# EAGLE schematic 7x7RGB-IR-J010129A (EAGLE 7.7.0)

## Sheet 1 of 2
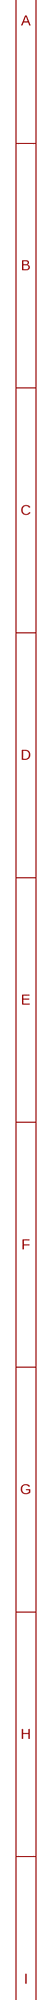
[diagram p0: schematic, sheet 1, part 1 of 2]
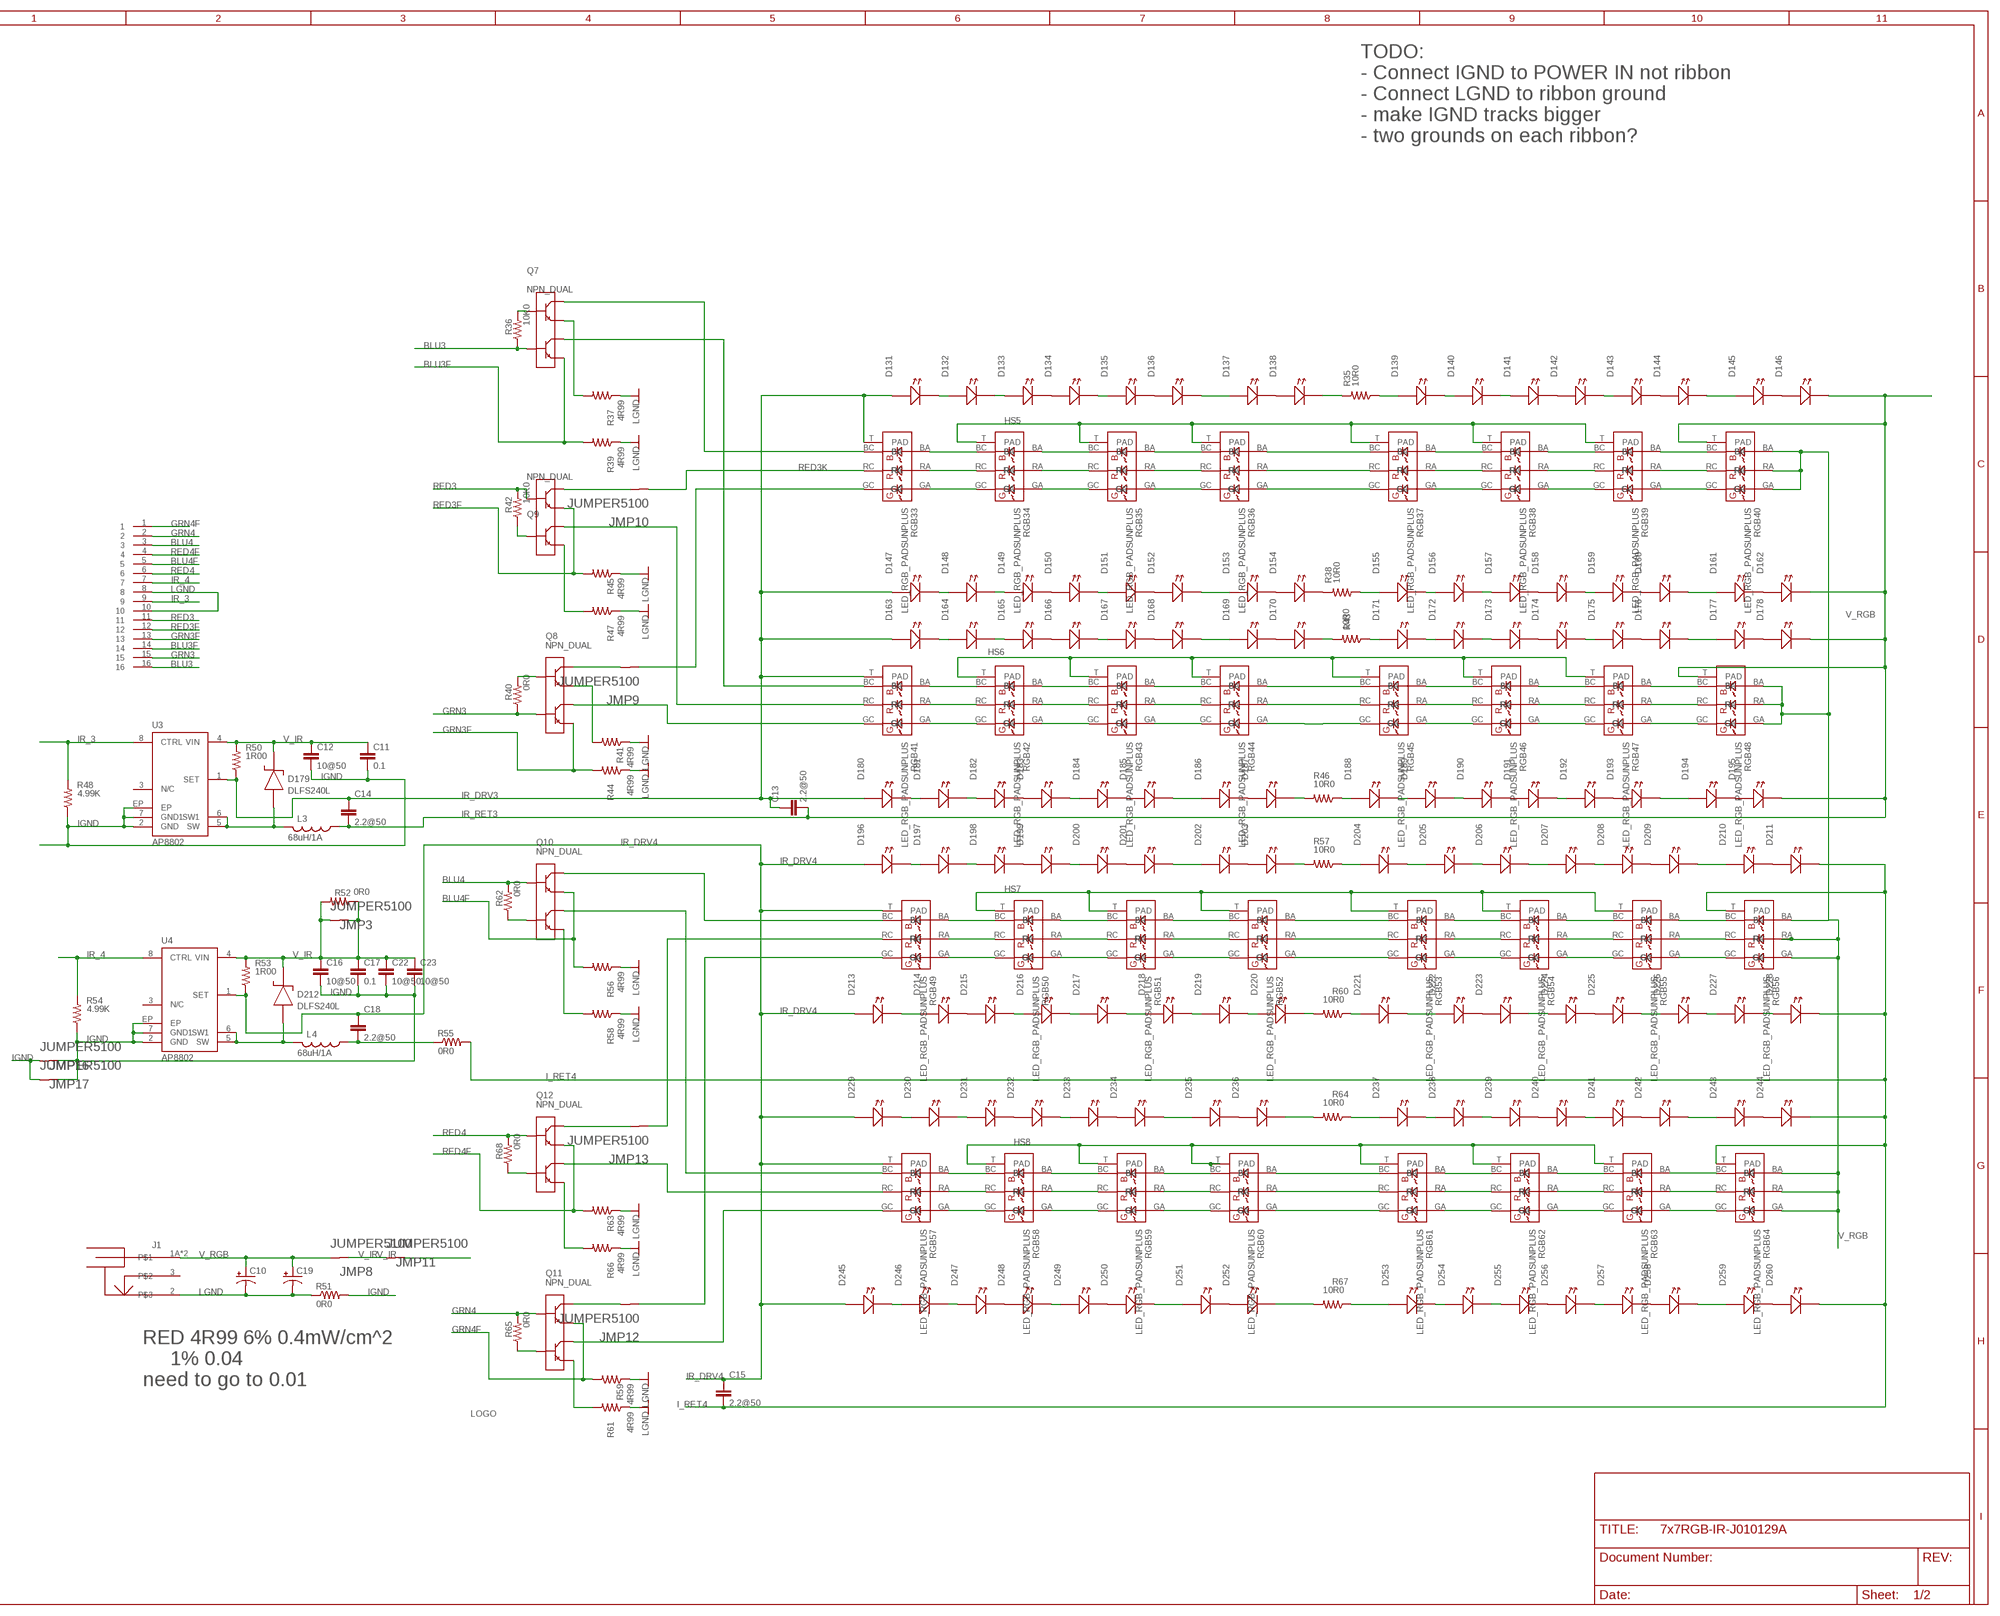
[diagram p1: schematic, sheet 1, part 2 of 2]

### Parts
C10  CPOL-US153CLV-0810  [153CLV-0810]
C11  0.1  CAPS0805S  [0805S]
C12  10@50  CAPS1210S  [1210S]
C13  2.2@50  CAPS1206S  [1206S]
C14  2.2@50  CAPS1206S  [1206S]
C15  2.2@50  CAPS1206S  [1206S]
C16  10@50  CAPS1210S  [1210S]
C17  0.1  CAPS0805S  [0805S]
C18  2.2@50  CAPS1206S  [1206S]
C19  CPOL-US153CLV-0810  [153CLV-0810]
C22  10@50  CAPS1210S  [1210S]
C23  10@50  CAPS1210S  [1210S]
D131  LEDLED_SFH4050  [LED_SFH4050]
D132  LEDLED_SFH4050  [LED_SFH4050]
D133  LEDLED_SFH4050  [LED_SFH4050]
D134  LEDLED_SFH4050  [LED_SFH4050]
D135  LEDLED_SFH4050  [LED_SFH4050]
D136  LEDLED_SFH4050  [LED_SFH4050]
D137  LEDLED_SFH4050  [LED_SFH4050]
D138  LEDLED_SFH4050  [LED_SFH4050]
D139  LEDLED_SFH4050  [LED_SFH4050]
D140  LEDLED_SFH4050  [LED_SFH4050]
D141  LEDLED_SFH4050  [LED_SFH4050]
D142  LEDLED_SFH4050  [LED_SFH4050]
D143  LEDLED_SFH4050  [LED_SFH4050]
D144  LEDLED_SFH4050  [LED_SFH4050]
D145  LEDLED_SFH4050  [LED_SFH4050]
D146  LEDLED_SFH4050  [LED_SFH4050]
D147  LEDLED_SFH4050  [LED_SFH4050]
D148  LEDLED_SFH4050  [LED_SFH4050]
D149  LEDLED_SFH4050  [LED_SFH4050]
D150  LEDLED_SFH4050  [LED_SFH4050]
D151  LEDLED_SFH4050  [LED_SFH4050]
D152  LEDLED_SFH4050  [LED_SFH4050]
D153  LEDLED_SFH4050  [LED_SFH4050]
D154  LEDLED_SFH4050  [LED_SFH4050]
D155  LEDLED_SFH4050  [LED_SFH4050]
D156  LEDLED_SFH4050  [LED_SFH4050]
D157  LEDLED_SFH4050  [LED_SFH4050]
D158  LEDLED_SFH4050  [LED_SFH4050]
D159  LEDLED_SFH4050  [LED_SFH4050]
D160  LEDLED_SFH4050  [LED_SFH4050]
D161  LEDLED_SFH4050  [LED_SFH4050]
D162  LEDLED_SFH4050  [LED_SFH4050]
D163  LEDLED_SFH4050  [LED_SFH4050]
D164  LEDLED_SFH4050  [LED_SFH4050]
D165  LEDLED_SFH4050  [LED_SFH4050]
D166  LEDLED_SFH4050  [LED_SFH4050]
D167  LEDLED_SFH4050  [LED_SFH4050]
D168  LEDLED_SFH4050  [LED_SFH4050]
D169  LEDLED_SFH4050  [LED_SFH4050]
D170  LEDLED_SFH4050  [LED_SFH4050]
D171  LEDLED_SFH4050  [LED_SFH4050]
D172  LEDLED_SFH4050  [LED_SFH4050]
D173  LEDLED_SFH4050  [LED_SFH4050]
D174  LEDLED_SFH4050  [LED_SFH4050]
D175  LEDLED_SFH4050  [LED_SFH4050]
D176  LEDLED_SFH4050  [LED_SFH4050]
D177  LEDLED_SFH4050  [LED_SFH4050]
D178  LEDLED_SFH4050  [LED_SFH4050]
D179  DLFS240L  DIODE_SCHOTTKYPWRDI-123  [PWRDI-123]
D180  LEDLED_SFH4050  [LED_SFH4050]
D181  LEDLED_SFH4050  [LED_SFH4050]
D182  LEDLED_SFH4050  [LED_SFH4050]
D183  LEDLED_SFH4050  [LED_SFH4050]
D184  LEDLED_SFH4050  [LED_SFH4050]
D185  LEDLED_SFH4050  [LED_SFH4050]
D186  LEDLED_SFH4050  [LED_SFH4050]
D187  LEDLED_SFH4050  [LED_SFH4050]
D188  LEDLED_SFH4050  [LED_SFH4050]
D189  LEDLED_SFH4050  [LED_SFH4050]
D190  LEDLED_SFH4050  [LED_SFH4050]
D191  LEDLED_SFH4050  [LED_SFH4050]
D192  LEDLED_SFH4050  [LED_SFH4050]
D193  LEDLED_SFH4050  [LED_SFH4050]
D194  LEDLED_SFH4050  [LED_SFH4050]
D195  LEDLED_SFH4050  [LED_SFH4050]
D196  LEDLED_SFH4050  [LED_SFH4050]
D197  LEDLED_SFH4050  [LED_SFH4050]
D198  LEDLED_SFH4050  [LED_SFH4050]
D199  LEDLED_SFH4050  [LED_SFH4050]
D200  LEDLED_SFH4050  [LED_SFH4050]
D201  LEDLED_SFH4050  [LED_SFH4050]
D202  LEDLED_SFH4050  [LED_SFH4050]
D203  LEDLED_SFH4050  [LED_SFH4050]
D204  LEDLED_SFH4050  [LED_SFH4050]
D205  LEDLED_SFH4050  [LED_SFH4050]
D206  LEDLED_SFH4050  [LED_SFH4050]
D207  LEDLED_SFH4050  [LED_SFH4050]
D208  LEDLED_SFH4050  [LED_SFH4050]
D209  LEDLED_SFH4050  [LED_SFH4050]
D210  LEDLED_SFH4050  [LED_SFH4050]
D211  LEDLED_SFH4050  [LED_SFH4050]
D212  DLFS240L  DIODE_SCHOTTKYPWRDI-123  [PWRDI-123]
D213  LEDLED_SFH4050  [LED_SFH4050]
D214  LEDLED_SFH4050  [LED_SFH4050]
D215  LEDLED_SFH4050  [LED_SFH4050]
D216  LEDLED_SFH4050  [LED_SFH4050]
D217  LEDLED_SFH4050  [LED_SFH4050]
D218  LEDLED_SFH4050  [LED_SFH4050]
D219  LEDLED_SFH4050  [LED_SFH4050]
D220  LEDLED_SFH4050  [LED_SFH4050]
D221  LEDLED_SFH4050  [LED_SFH4050]
D222  LEDLED_SFH4050  [LED_SFH4050]
D223  LEDLED_SFH4050  [LED_SFH4050]
D224  LEDLED_SFH4050  [LED_SFH4050]
D225  LEDLED_SFH4050  [LED_SFH4050]
D226  LEDLED_SFH4050  [LED_SFH4050]
D227  LEDLED_SFH4050  [LED_SFH4050]
D228  LEDLED_SFH4050  [LED_SFH4050]
D229  LEDLED_SFH4050  [LED_SFH4050]
D230  LEDLED_SFH4050  [LED_SFH4050]
D231  LEDLED_SFH4050  [LED_SFH4050]
D232  LEDLED_SFH4050  [LED_SFH4050]
D233  LEDLED_SFH4050  [LED_SFH4050]
D234  LEDLED_SFH4050  [LED_SFH4050]
D235  LEDLED_SFH4050  [LED_SFH4050]
D236  LEDLED_SFH4050  [LED_SFH4050]
D237  LEDLED_SFH4050  [LED_SFH4050]
D238  LEDLED_SFH4050  [LED_SFH4050]
D239  LEDLED_SFH4050  [LED_SFH4050]
D240  LEDLED_SFH4050  [LED_SFH4050]
D241  LEDLED_SFH4050  [LED_SFH4050]
D242  LEDLED_SFH4050  [LED_SFH4050]
D243  LEDLED_SFH4050  [LED_SFH4050]
D244  LEDLED_SFH4050  [LED_SFH4050]
D245  LEDLED_SFH4050  [LED_SFH4050]
D246  LEDLED_SFH4050  [LED_SFH4050]
D247  LEDLED_SFH4050  [LED_SFH4050]
D248  LEDLED_SFH4050  [LED_SFH4050]
D249  LEDLED_SFH4050  [LED_SFH4050]
D250  LEDLED_SFH4050  [LED_SFH4050]
D251  LEDLED_SFH4050  [LED_SFH4050]
D252  LEDLED_SFH4050  [LED_SFH4050]
D253  LEDLED_SFH4050  [LED_SFH4050]
D254  LEDLED_SFH4050  [LED_SFH4050]
D255  LEDLED_SFH4050  [LED_SFH4050]
D256  LEDLED_SFH4050  [LED_SFH4050]
D257  LEDLED_SFH4050  [LED_SFH4050]
D258  LEDLED_SFH4050  [LED_SFH4050]
D259  LEDLED_SFH4050  [LED_SFH4050]
D260  LEDLED_SFH4050  [LED_SFH4050]
J1  POWER_JACK_SHUNTPJ-002  [PJ-002]
JMP3  JUMPER5100  [5100]
JMP8  JUMPER5100  [5100]
JMP9  JUMPER5100  [5100]
JMP10  JUMPER5100  [5100]
JMP11  JUMPER5100  [5100]
JMP12  JUMPER5100  [5100]
JMP13  JUMPER5100  [5100]
JMP16  JUMPER5100  [5100]
JMP17  JUMPER5100  [5100]
L3  68uH/1A  INDUCTOR_SMSRU8043  [SRU8043]
L4  68uH/1A  INDUCTOR_SMSRU8043  [SRU8043]
P2  CON162X8SM-SMALL  [HEADER2X8_SM_SMALL]
Q7  NPN_DUAL  [LFPAK56D]
Q8  NPN_DUAL  [LFPAK56D]
Q9  NPN_DUAL  [LFPAK56D]
Q10  NPN_DUAL  [LFPAK56D]
Q11  NPN_DUAL  [LFPAK56D]
Q12  NPN_DUAL  [LFPAK56D]
R35  10R0  RESISTOR_SM1206S  [1206S]
R36  10K0  RESISTOR_SM1206S  [1206S]
R37  4R99  R-US_R2512  [R2512]
R38  10R0  RESISTOR_SM1206S  [1206S]
R39  4R99  R-US_R2512  [R2512]
R40  0R0  RESISTOR_SM1206S  [1206S]
R41  4R99  R-US_R2512  [R2512]
R42  10K0  RESISTOR_SM1206S  [1206S]
R43  10R0  RESISTOR_SM1206S  [1206S]
R44  4R99  R-US_R2512  [R2512]
R45  4R99  R-US_R2512  [R2512]
R46  10R0  RESISTOR_SM1206S  [1206S]
R47  4R99  R-US_R2512  [R2512]
R48  4.99K  RESISTOR_SM0805S  [0805S]
R50  1R00  RESISTOR_SM1206S  [1206S]
R51  0R0  RESISTOR_SM1206S  [1206S]
R52  0R0  R-US_R1206  [R1206]
R53  1R00  RESISTOR_SM1206S  [1206S]
R54  4.99K  RESISTOR_SM0805S  [0805S]
R55  0R0  RESISTOR_SM1206S  [1206S]
R56  4R99  R-US_R2512  [R2512]
R57  10R0  RESISTOR_SM1206S  [1206S]
R58  4R99  R-US_R2512  [R2512]
R59  4R99  R-US_R2512  [R2512]
R60  10R0  RESISTOR_SM1206S  [1206S]
R61  4R99  R-US_R2512  [R2512]
R62  0R0  RESISTOR_SM1206S  [1206S]
R63  4R99  R-US_R2512  [R2512]
R64  10R0  RESISTOR_SM1206S  [1206S]
R65  0R0  RESISTOR_SM1206S  [1206S]
R66  4R99  R-US_R2512  [R2512]
R67  10R0  RESISTOR_SM1206S  [1206S]
R68  0R0  RESISTOR_SM1206S  [1206S]
RGB33  LED_RGB_PADSUNPLUS  [SUNPLUS_RGB]
RGB34  LED_RGB_PADSUNPLUS  [SUNPLUS_RGB]
RGB35  LED_RGB_PADSUNPLUS  [SUNPLUS_RGB]
RGB36  LED_RGB_PADSUNPLUS  [SUNPLUS_RGB]
RGB37  LED_RGB_PADSUNPLUS  [SUNPLUS_RGB]
RGB38  LED_RGB_PADSUNPLUS  [SUNPLUS_RGB]
RGB39  LED_RGB_PADSUNPLUS  [SUNPLUS_RGB]
RGB40  LED_RGB_PADSUNPLUS  [SUNPLUS_RGB]
RGB41  LED_RGB_PADSUNPLUS  [SUNPLUS_RGB]
RGB42  LED_RGB_PADSUNPLUS  [SUNPLUS_RGB]
RGB43  LED_RGB_PADSUNPLUS  [SUNPLUS_RGB]
RGB44  LED_RGB_PADSUNPLUS  [SUNPLUS_RGB]
RGB45  LED_RGB_PADSUNPLUS  [SUNPLUS_RGB]
RGB46  LED_RGB_PADSUNPLUS  [SUNPLUS_RGB]
RGB47  LED_RGB_PADSUNPLUS  [SUNPLUS_RGB]
RGB48  LED_RGB_PADSUNPLUS  [SUNPLUS_RGB]
RGB49  LED_RGB_PADSUNPLUS  [SUNPLUS_RGB]
RGB50  LED_RGB_PADSUNPLUS  [SUNPLUS_RGB]
RGB51  LED_RGB_PADSUNPLUS  [SUNPLUS_RGB]
RGB52  LED_RGB_PADSUNPLUS  [SUNPLUS_RGB]
RGB53  LED_RGB_PADSUNPLUS  [SUNPLUS_RGB]
RGB54  LED_RGB_PADSUNPLUS  [SUNPLUS_RGB]
RGB55  LED_RGB_PADSUNPLUS  [SUNPLUS_RGB]
RGB56  LED_RGB_PADSUNPLUS  [SUNPLUS_RGB]
RGB57  LED_RGB_PADSUNPLUS  [SUNPLUS_RGB]
RGB58  LED_RGB_PADSUNPLUS  [SUNPLUS_RGB]
RGB59  LED_RGB_PADSUNPLUS  [SUNPLUS_RGB]
RGB60  LED_RGB_PADSUNPLUS  [SUNPLUS_RGB]
RGB61  LED_RGB_PADSUNPLUS  [SUNPLUS_RGB]
RGB62  LED_RGB_PADSUNPLUS  [SUNPLUS_RGB]
RGB63  LED_RGB_PADSUNPLUS  [SUNPLUS_RGB]
RGB64  LED_RGB_PADSUNPLUS  [SUNPLUS_RGB]
U3  AP8802  [SOIC8-EP]
U4  AP8802  [SOIC8-EP]
U$19  JFRC-LOGOLOGO_OP  [LOGO_BMP_OP]

### Nets
BLU3: P2.16 Q7.4(B2) R36.1
BLU3F: P2.14 Q7.3(E2) R39.2
BLU3K: Q7.7(C1) Q7.8(C1) Q7.78(C1) RGB33.BC
BLU4: P2.3 Q10.2(B1) R62.2
BLU4F: P2.5 Q10.1(E1) R56.2
G4: Q11.3(E2) R61.2
G4A: Q11.4(B2) R65.1
GRN3: P2.15 Q8.4(B2) R40.1
GRN3F: P2.13 Q8.3(E2) R44.2
GRN3K: JMP9.1 RGB33.GC
GRN4: P2.2 Q11.2(B1) R65.2
GRN4F: P2.1 Q11.1(E1) R59.2
GULA_1: Q11.5(C2) Q11.6(C2) Q11.56(C2) RGB57.GC
GULA_2: Q12.5(C2) Q12.6(C2) Q12.56(C2) RGB57.RC
GULA_3: Q8.5(C2) Q8.6(C2) Q8.56(C2) RGB41.GC
GULA_4: Q9.5(C2) Q9.6(C2) Q9.56(C2) RGB41.RC
HS5: RGB34.T(PAD) RGB35.T(PAD) RGB36.T(PAD) RGB37.T(PAD) RGB38.T(PAD) RGB39.T(PAD)
HS6: RGB42.T(PAD) RGB43.T(PAD) RGB44.T(PAD) RGB45.T(PAD) RGB46.T(PAD) RGB47.T(PAD)
HS7: RGB50.T(PAD) RGB51.T(PAD) RGB52.T(PAD) RGB53.T(PAD) RGB54.T(PAD) RGB55.T(PAD)
HS8: RGB58.T(PAD) RGB59.T(PAD) RGB60.T(PAD) RGB61.T(PAD) RGB62.T(PAD) RGB63.T(PAD)
I_RET4: C15.2 D211.C(K) D228.C(K) D244.C(K) D260.C(K) R55.2 RGB56.T(PAD) RGB64.T(PAD)
IGND: C11.2 C12.2 C16.2 C17.2 C22.2 C23.2 JMP16.1 JMP16.2 JMP17.1 JMP17.2 R48.1 R51.2 R54.1 U3.2(GND) U3.7(GND1) U3.EP U4.2(GND) U4.7(GND1) U4.EP
IR_3: P2.9 R48.2 U3.8(CTRL)
IR_4: P2.7 R54.2 U4.8(CTRL)
IR_DRV3: C13.1 C14.1 D131.A D147.A D163.A D180.A R50.1 RGB33.T(PAD) RGB41.T(PAD) U3.1(SET)
IR_DRV4: C15.1 C18.1 D196.A D213.A D229.A D245.A R53.1 RGB49.T(PAD) RGB57.T(PAD) U4.1(SET)
IR_RET3: C13.2 C14.2 D146.C(K) D162.C(K) D178.C(K) D195.C(K) L3.1 RGB40.T(PAD) RGB48.T(PAD)
LGND: C10.- C19.- J1.2 P2.8 P2.10 R37.1 R39.1 R41.1 R44.1 R45.1 R47.1 R51.1 R56.1 R58.1 R59.1 R61.1 R63.1 R66.1 ; also sheet 2
N$2: D227.C(K) D228.A
N$3: Q12.4(B2) R68.1
N$4: Q8.1(E1) R41.2
N$5: JMP12.1 RGB49.GC
N$6: Q10.7(C1) Q10.8(C1) Q10.78(C1) RGB49.BC
N$8: Q10.5(C2) Q10.6(C2) Q10.56(C2) RGB57.BC
N$9: Q9.3(E2) R47.2
N$10: Q9.4(B2) R42.1
N$11: Q8.2(B1) R40.2
N$14: D139.A R35.1
N$15: JMP13.2 Q12.7(C1) Q12.8(C1) Q12.78(C1)
N$16: JMP12.2 Q11.7(C1) Q11.8(C1) Q11.78(C1)
N$17: D138.C(K) R35.2
N$18: D154.C(K) R38.2
N$19: D155.A R38.1
N$20: JMP13.1 RGB49.RC
N$21: D171.A R43.1
N$22: D170.C(K) R43.2
N$23: D188.A R46.1
N$24: D187.C(K) R46.2
N$25: D203.C(K) R57.2
N$26: RGB63.BA RGB64.BC
N$27: D212.A L4.2 U4.5(SW) U4.6(SW1)
N$29: C18.2 L4.1 R55.1
N$30: RGB63.RA RGB64.RC
N$31: D204.A R57.1
N$32: D221.A R60.1
N$33: D220.C(K) R60.2
N$34: D237.A R64.1
N$35: Q10.4(B2) R62.1
N$36: Q10.3(E2) R58.2
N$37: D236.C(K) R64.2
N$38: D253.A R67.1
N$39: D252.C(K) R67.2
N$67: D179.A L3.2 U3.5(SW) U3.6(SW1)
N$97: RGB47.GA RGB48.GC
N$177: RGB46.GA RGB47.GC
N$178: RGB45.GA RGB46.GC
N$179: RGB44.GA RGB45.GC
N$181: RGB43.GA RGB44.GC
N$188: RGB42.GA RGB43.GC
N$190: RGB63.GA RGB64.GC
N$230: RGB41.GA RGB42.GC
N$233: RGB47.RA RGB48.RC
N$235: RGB46.RA RGB47.RC
N$238: RGB45.RA RGB46.RC
N$239: RGB44.RA RGB45.RC
N$240: RGB43.RA RGB44.RC
N$241: RGB42.RA RGB43.RC
N$242: RGB41.RA RGB42.RC
N$243: RGB41.BA RGB42.BC
N$244: RGB42.BA RGB43.BC
N$245: RGB43.BA RGB44.BC
N$248: RGB44.BA RGB45.BC
N$249: RGB45.BA RGB46.BC
N$250: RGB46.BA RGB47.BC
N$251: RGB47.BA RGB48.BC
N$256: D181.C(K) D182.A
N$257: D182.C(K) D183.A
N$261: RGB33.RA RGB34.RC
N$264: D184.C(K) D185.A
N$265: D186.C(K) D187.A
N$268: D180.C(K) D181.A
N$269: D183.C(K) D184.A
N$270: D185.C(K) D186.A
N$271: D189.C(K) D190.A
N$272: D190.C(K) D191.A
N$273: D192.C(K) D193.A
N$274: D194.C(K) D195.A
N$275: D188.C(K) D189.A
N$276: D191.C(K) D192.A
N$277: D193.C(K) D194.A
N$278: D164.C(K) D165.A
N$279: D165.C(K) D166.A
N$280: D167.C(K) D168.A
N$281: D169.C(K) D170.A
N$282: D163.C(K) D164.A
N$283: D166.C(K) D167.A
N$284: D168.C(K) D169.A
N$285: D172.C(K) D173.A
N$286: D173.C(K) D174.A
N$287: D175.C(K) D176.A
N$288: D177.C(K) D178.A
N$289: D171.C(K) D172.A
N$290: D174.C(K) D175.A
N$291: D176.C(K) D177.A
N$294: RGB55.GA RGB56.GC
N$295: RGB54.GA RGB55.GC
N$296: RGB53.GA RGB54.GC
N$297: RGB52.GA RGB53.GC
N$298: RGB51.GA RGB52.GC
N$299: RGB50.GA RGB51.GC
N$300: RGB49.GA RGB50.GC
N$301: RGB55.RA RGB56.RC
N$302: RGB54.RA RGB55.RC
N$303: RGB53.RA RGB54.RC
N$304: RGB52.RA RGB53.RC
N$305: RGB51.RA RGB52.RC
N$306: RGB50.RA RGB51.RC
N$307: RGB49.RA RGB50.RC
N$308: RGB49.BA RGB50.BC
N$309: RGB50.BA RGB51.BC
N$310: RGB51.BA RGB52.BC
N$311: RGB52.BA RGB53.BC
N$312: RGB53.BA RGB54.BC
N$313: RGB54.BA RGB55.BC
N$314: RGB55.BA RGB56.BC
N$315: D197.C(K) D198.A
N$316: D198.C(K) D199.A
N$317: D200.C(K) D201.A
N$318: D202.C(K) D203.A
N$319: D196.C(K) D197.A
N$320: D199.C(K) D200.A
N$321: D201.C(K) D202.A
N$322: D205.C(K) D206.A
N$323: D206.C(K) D207.A
N$324: D208.C(K) D209.A
N$325: D210.C(K) D211.A
N$326: D204.C(K) D205.A
N$327: D207.C(K) D208.A
N$328: D209.C(K) D210.A
N$329: D214.C(K) D215.A
N$330: D215.C(K) D216.A
N$331: D217.C(K) D218.A
N$332: D219.C(K) D220.A
N$333: D213.C(K) D214.A
N$334: D216.C(K) D217.A
N$335: D218.C(K) D219.A
N$336: D222.C(K) D223.A
N$337: D224.C(K) D225.A
N$338: D226.C(K) D227.A
N$339: D221.C(K) D222.A
N$340: D223.C(K) D224.A
N$341: D225.C(K) D226.A
N$344: RGB39.GA RGB40.GC
N$345: RGB38.GA RGB39.GC
N$346: RGB37.GA RGB38.GC
N$347: RGB36.GA RGB37.GC
N$348: RGB35.GA RGB36.GC
N$349: RGB34.GA RGB35.GC
N$350: RGB33.GA RGB34.GC
N$351: RGB39.RA RGB40.RC
N$352: RGB38.RA RGB39.RC
N$353: RGB37.RA RGB38.RC
N$354: RGB36.RA RGB37.RC
N$355: RGB35.RA RGB36.RC
N$356: RGB34.RA RGB35.RC
N$358: RGB33.BA RGB34.BC
N$359: RGB34.BA RGB35.BC
N$360: RGB35.BA RGB36.BC
N$361: RGB36.BA RGB37.BC
N$362: RGB37.BA RGB38.BC
N$363: RGB38.BA RGB39.BC
N$364: RGB39.BA RGB40.BC
N$365: D132.C(K) D133.A
N$366: D133.C(K) D134.A
N$367: D135.C(K) D136.A
N$368: D137.C(K) D138.A
N$369: D131.C(K) D132.A
N$370: D134.C(K) D135.A
N$371: D136.C(K) D137.A
N$372: D140.C(K) D141.A
N$373: D141.C(K) D142.A
N$374: D143.C(K) D144.A
N$375: D145.C(K) D146.A
N$376: D139.C(K) D140.A
N$377: D142.C(K) D143.A
N$378: D144.C(K) D145.A
N$379: D148.C(K) D149.A
N$380: D149.C(K) D150.A
N$381: D151.C(K) D152.A
N$382: D153.C(K) D154.A
N$383: D147.C(K) D148.A
N$384: D150.C(K) D151.A
N$385: D152.C(K) D153.A
N$386: D156.C(K) D157.A
N$387: D157.C(K) D158.A
N$388: D159.C(K) D160.A
N$389: D161.C(K) D162.A
N$390: D155.C(K) D156.A
N$391: D158.C(K) D159.A
N$392: D160.C(K) D161.A
N$400: Q7.1(E1) R37.2
N$401: Q7.5(C2) Q7.6(C2) Q7.56(C2) RGB41.BC
N$404: RGB62.GA RGB63.GC
N$405: RGB61.GA RGB62.GC
N$406: RGB60.GA RGB61.GC
N$407: RGB59.GA RGB60.GC
N$408: RGB58.GA RGB59.GC
N$409: RGB57.GA RGB58.GC
N$411: RGB62.RA RGB63.RC
N$412: RGB61.RA RGB62.RC
N$413: RGB60.RA RGB61.RC
N$414: RGB59.RA RGB60.RC
N$415: RGB58.RA RGB59.RC
N$416: RGB57.RA RGB58.RC
N$417: RGB57.BA RGB58.BC
N$418: RGB58.BA RGB59.BC
N$419: RGB59.BA RGB60.BC
N$420: RGB60.BA RGB61.BC
N$421: RGB61.BA RGB62.BC
N$422: RGB62.BA RGB63.BC
N$424: D230.C(K) D231.A
N$425: D231.C(K) D232.A
N$426: D233.C(K) D234.A
N$427: D235.C(K) D236.A
N$428: D229.C(K) D230.A
N$429: D232.C(K) D233.A
N$430: D234.C(K) D235.A
N$431: D238.C(K) D239.A
N$432: D239.C(K) D240.A
N$433: D241.C(K) D242.A
N$434: D243.C(K) D244.A
N$435: D237.C(K) D238.A
N$436: D240.C(K) D241.A
N$437: D242.C(K) D243.A
N$438: D246.C(K) D247.A
N$439: D247.C(K) D248.A
N$440: D249.C(K) D250.A
N$441: D251.C(K) D252.A
N$442: D245.C(K) D246.A
N$443: D248.C(K) D249.A
N$444: D250.C(K) D251.A
N$445: D254.C(K) D255.A
N$446: D255.C(K) D256.A
N$447: D257.C(K) D258.A
N$448: D259.C(K) D260.A
N$449: D253.C(K) D254.A
N$450: D256.C(K) D257.A
N$451: D258.C(K) D259.A
N$481: JMP10.2 Q9.7(C1) Q9.8(C1) Q9.78(C1)
N$482: JMP9.2 Q8.7(C1) Q8.8(C1) Q8.78(C1)
N$484: Q7.2(B1) R36.2
R4: Q12.3(E2) R66.2
RED3: P2.11 Q9.2(B1) R42.2
RED3F: P2.12 Q9.1(E1) R45.2
RED3K: JMP10.1 RGB33.RC
RED4: P2.6 Q12.2(B1) R68.2
RED4F: P2.4 Q12.1(E1) R63.2
V_IR: C11.1 C12.1 C16.1 C17.1 C22.1 C23.1 D179.K D212.K JMP3.1 JMP3.2 JMP8.2 JMP11.1 JMP11.2 R50.2 R52.1 R52.2 R53.2 U3.4(VIN) U4.4(VIN)
V_RGB: C10.+ C19.+ J1.1A J1.1B JMP8.1 RGB40.BA RGB40.GA RGB40.RA RGB48.BA RGB48.GA RGB48.RA RGB56.BA RGB56.GA RGB56.RA RGB64.BA RGB64.GA RGB64.RA ; also sheet 2
Unconnected: J1.3 U3.3(N/C) U4.3(N/C)

### Notes on the sheet
- TODO:
  - Connect IGND to POWER IN not ribbon
  - Connect LGND to ribbon ground
  - make IGND tracks bigger
  - two grounds on each ribbon?
- RED 4R99 6% 0.4mW/cm^2
       1% 0.04
  need to go to 0.01

## Sheet 2 of 2
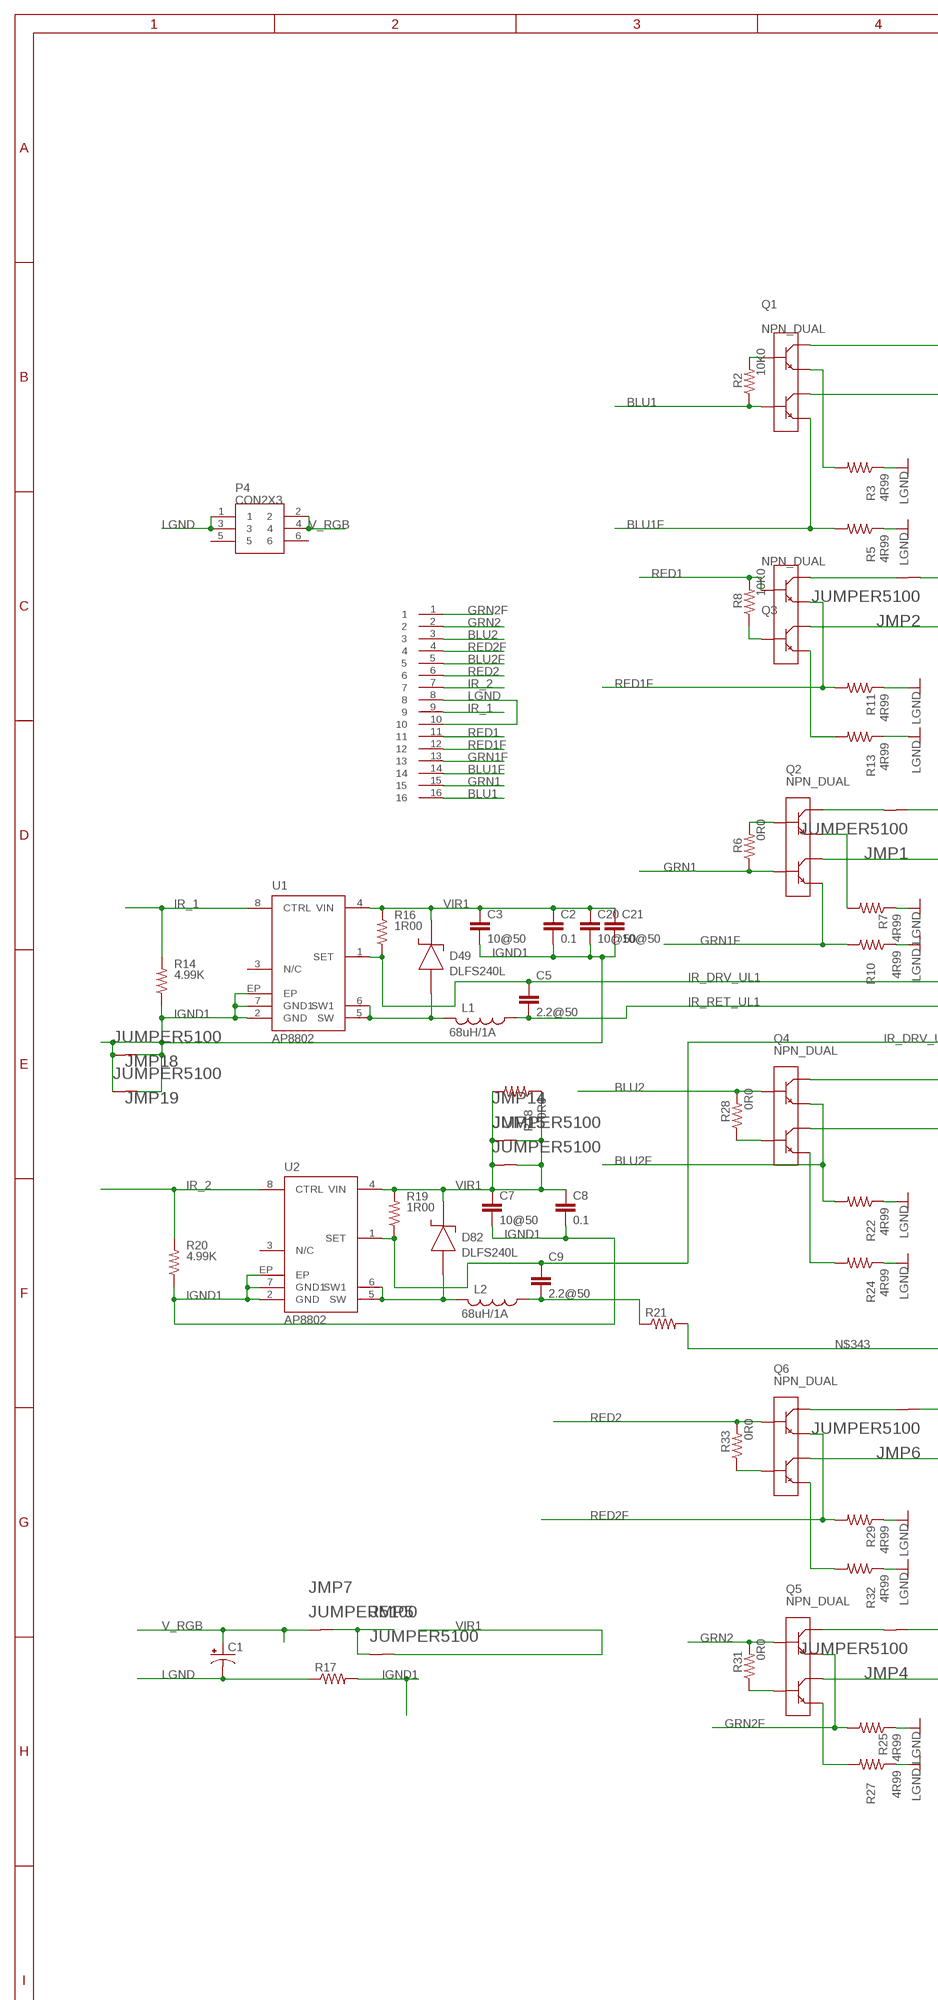
[diagram p2: schematic, sheet 2, part 1 of 2]
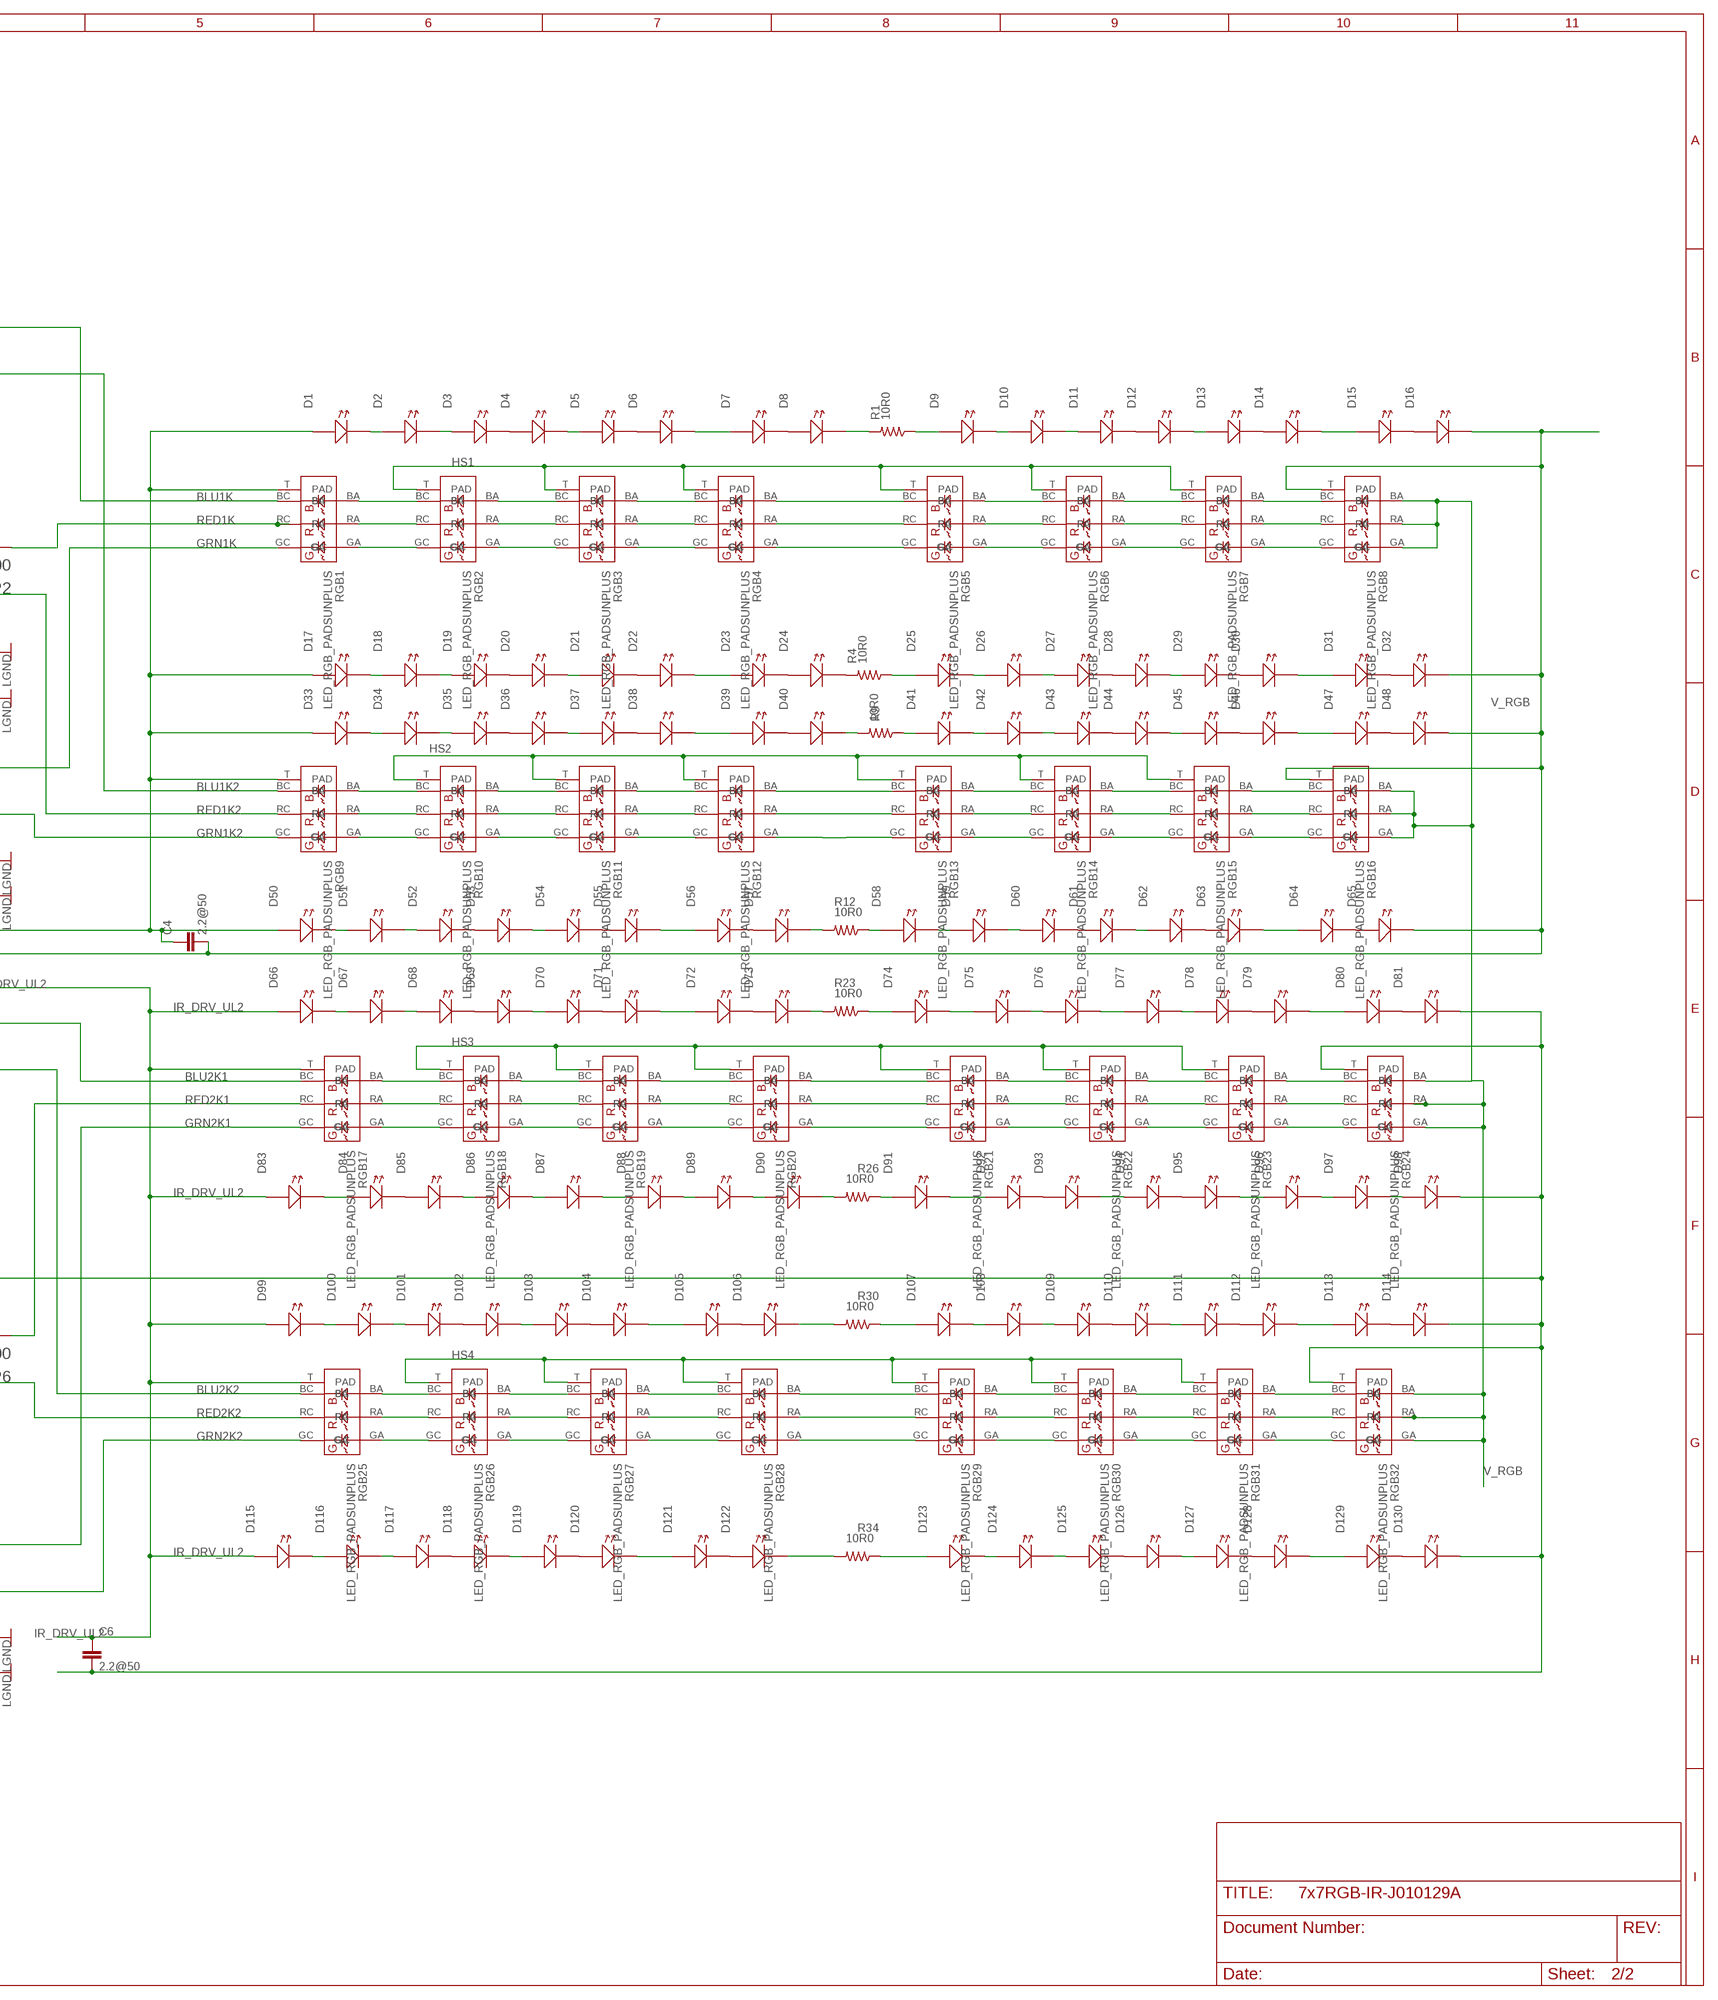
[diagram p3: schematic, sheet 2, part 2 of 2]

### Parts
C1  CPOL-US153CLV-0810  [153CLV-0810]
C2  0.1  CAPS0805S  [0805S]
C3  10@50  CAPS1210S  [1210S]
C4  2.2@50  CAPS1206S  [1206S]
C5  2.2@50  CAPS1206S  [1206S]
C6  2.2@50  CAPS1206S  [1206S]
C7  10@50  CAPS1210S  [1210S]
C8  0.1  CAPS0805S  [0805S]
C9  2.2@50  CAPS1206S  [1206S]
C20  10@50  CAPS1210S  [1210S]
C21  10@50  CAPS1210S  [1210S]
D1  LEDLED_SFH4050  [LED_SFH4050]
D2  LEDLED_SFH4050  [LED_SFH4050]
D3  LEDLED_SFH4050  [LED_SFH4050]
D4  LEDLED_SFH4050  [LED_SFH4050]
D5  LEDLED_SFH4050  [LED_SFH4050]
D6  LEDLED_SFH4050  [LED_SFH4050]
D7  LEDLED_SFH4050  [LED_SFH4050]
D8  LEDLED_SFH4050  [LED_SFH4050]
D9  LEDLED_SFH4050  [LED_SFH4050]
D10  LEDLED_SFH4050  [LED_SFH4050]
D11  LEDLED_SFH4050  [LED_SFH4050]
D12  LEDLED_SFH4050  [LED_SFH4050]
D13  LEDLED_SFH4050  [LED_SFH4050]
D14  LEDLED_SFH4050  [LED_SFH4050]
D15  LEDLED_SFH4050  [LED_SFH4050]
D16  LEDLED_SFH4050  [LED_SFH4050]
D17  LEDLED_SFH4050  [LED_SFH4050]
D18  LEDLED_SFH4050  [LED_SFH4050]
D19  LEDLED_SFH4050  [LED_SFH4050]
D20  LEDLED_SFH4050  [LED_SFH4050]
D21  LEDLED_SFH4050  [LED_SFH4050]
D22  LEDLED_SFH4050  [LED_SFH4050]
D23  LEDLED_SFH4050  [LED_SFH4050]
D24  LEDLED_SFH4050  [LED_SFH4050]
D25  LEDLED_SFH4050  [LED_SFH4050]
D26  LEDLED_SFH4050  [LED_SFH4050]
D27  LEDLED_SFH4050  [LED_SFH4050]
D28  LEDLED_SFH4050  [LED_SFH4050]
D29  LEDLED_SFH4050  [LED_SFH4050]
D30  LEDLED_SFH4050  [LED_SFH4050]
D31  LEDLED_SFH4050  [LED_SFH4050]
D32  LEDLED_SFH4050  [LED_SFH4050]
D33  LEDLED_SFH4050  [LED_SFH4050]
D34  LEDLED_SFH4050  [LED_SFH4050]
D35  LEDLED_SFH4050  [LED_SFH4050]
D36  LEDLED_SFH4050  [LED_SFH4050]
D37  LEDLED_SFH4050  [LED_SFH4050]
D38  LEDLED_SFH4050  [LED_SFH4050]
D39  LEDLED_SFH4050  [LED_SFH4050]
D40  LEDLED_SFH4050  [LED_SFH4050]
D41  LEDLED_SFH4050  [LED_SFH4050]
D42  LEDLED_SFH4050  [LED_SFH4050]
D43  LEDLED_SFH4050  [LED_SFH4050]
D44  LEDLED_SFH4050  [LED_SFH4050]
D45  LEDLED_SFH4050  [LED_SFH4050]
D46  LEDLED_SFH4050  [LED_SFH4050]
D47  LEDLED_SFH4050  [LED_SFH4050]
D48  LEDLED_SFH4050  [LED_SFH4050]
D49  DLFS240L  DIODE_SCHOTTKYPWRDI-123  [PWRDI-123]
D50  LEDLED_SFH4050  [LED_SFH4050]
D51  LEDLED_SFH4050  [LED_SFH4050]
D52  LEDLED_SFH4050  [LED_SFH4050]
D53  LEDLED_SFH4050  [LED_SFH4050]
D54  LEDLED_SFH4050  [LED_SFH4050]
D55  LEDLED_SFH4050  [LED_SFH4050]
D56  LEDLED_SFH4050  [LED_SFH4050]
D57  LEDLED_SFH4050  [LED_SFH4050]
D58  LEDLED_SFH4050  [LED_SFH4050]
D59  LEDLED_SFH4050  [LED_SFH4050]
D60  LEDLED_SFH4050  [LED_SFH4050]
D61  LEDLED_SFH4050  [LED_SFH4050]
D62  LEDLED_SFH4050  [LED_SFH4050]
D63  LEDLED_SFH4050  [LED_SFH4050]
D64  LEDLED_SFH4050  [LED_SFH4050]
D65  LEDLED_SFH4050  [LED_SFH4050]
D66  LEDLED_SFH4050  [LED_SFH4050]
D67  LEDLED_SFH4050  [LED_SFH4050]
D68  LEDLED_SFH4050  [LED_SFH4050]
D69  LEDLED_SFH4050  [LED_SFH4050]
D70  LEDLED_SFH4050  [LED_SFH4050]
D71  LEDLED_SFH4050  [LED_SFH4050]
D72  LEDLED_SFH4050  [LED_SFH4050]
D73  LEDLED_SFH4050  [LED_SFH4050]
D74  LEDLED_SFH4050  [LED_SFH4050]
D75  LEDLED_SFH4050  [LED_SFH4050]
D76  LEDLED_SFH4050  [LED_SFH4050]
D77  LEDLED_SFH4050  [LED_SFH4050]
D78  LEDLED_SFH4050  [LED_SFH4050]
D79  LEDLED_SFH4050  [LED_SFH4050]
D80  LEDLED_SFH4050  [LED_SFH4050]
D81  LEDLED_SFH4050  [LED_SFH4050]
D82  DLFS240L  DIODE_SCHOTTKYPWRDI-123  [PWRDI-123]
D83  LEDLED_SFH4050  [LED_SFH4050]
D84  LEDLED_SFH4050  [LED_SFH4050]
D85  LEDLED_SFH4050  [LED_SFH4050]
D86  LEDLED_SFH4050  [LED_SFH4050]
D87  LEDLED_SFH4050  [LED_SFH4050]
D88  LEDLED_SFH4050  [LED_SFH4050]
D89  LEDLED_SFH4050  [LED_SFH4050]
D90  LEDLED_SFH4050  [LED_SFH4050]
D91  LEDLED_SFH4050  [LED_SFH4050]
D92  LEDLED_SFH4050  [LED_SFH4050]
D93  LEDLED_SFH4050  [LED_SFH4050]
D94  LEDLED_SFH4050  [LED_SFH4050]
D95  LEDLED_SFH4050  [LED_SFH4050]
D96  LEDLED_SFH4050  [LED_SFH4050]
D97  LEDLED_SFH4050  [LED_SFH4050]
D98  LEDLED_SFH4050  [LED_SFH4050]
D99  LEDLED_SFH4050  [LED_SFH4050]
D100  LEDLED_SFH4050  [LED_SFH4050]
D101  LEDLED_SFH4050  [LED_SFH4050]
D102  LEDLED_SFH4050  [LED_SFH4050]
D103  LEDLED_SFH4050  [LED_SFH4050]
D104  LEDLED_SFH4050  [LED_SFH4050]
D105  LEDLED_SFH4050  [LED_SFH4050]
D106  LEDLED_SFH4050  [LED_SFH4050]
D107  LEDLED_SFH4050  [LED_SFH4050]
D108  LEDLED_SFH4050  [LED_SFH4050]
D109  LEDLED_SFH4050  [LED_SFH4050]
D110  LEDLED_SFH4050  [LED_SFH4050]
D111  LEDLED_SFH4050  [LED_SFH4050]
D112  LEDLED_SFH4050  [LED_SFH4050]
D113  LEDLED_SFH4050  [LED_SFH4050]
D114  LEDLED_SFH4050  [LED_SFH4050]
D115  LEDLED_SFH4050  [LED_SFH4050]
D116  LEDLED_SFH4050  [LED_SFH4050]
D117  LEDLED_SFH4050  [LED_SFH4050]
D118  LEDLED_SFH4050  [LED_SFH4050]
D119  LEDLED_SFH4050  [LED_SFH4050]
D120  LEDLED_SFH4050  [LED_SFH4050]
D121  LEDLED_SFH4050  [LED_SFH4050]
D122  LEDLED_SFH4050  [LED_SFH4050]
D123  LEDLED_SFH4050  [LED_SFH4050]
D124  LEDLED_SFH4050  [LED_SFH4050]
D125  LEDLED_SFH4050  [LED_SFH4050]
D126  LEDLED_SFH4050  [LED_SFH4050]
D127  LEDLED_SFH4050  [LED_SFH4050]
D128  LEDLED_SFH4050  [LED_SFH4050]
D129  LEDLED_SFH4050  [LED_SFH4050]
D130  LEDLED_SFH4050  [LED_SFH4050]
JMP1  JUMPER5100  [5100]
JMP2  JUMPER5100  [5100]
JMP4  JUMPER5100  [5100]
JMP5  JUMPER5100  [5100]
JMP6  JUMPER5100  [5100]
JMP7  JUMPER5100  [5100]
JMP14  JUMPER5100  [5100]
JMP15  JUMPER5100  [5100]
JMP18  JUMPER5100  [5100]
JMP19  JUMPER5100  [5100]
L1  68uH/1A  INDUCTOR_SMSRU8043  [SRU8043]
L2  68uH/1A  INDUCTOR_SMSRU8043  [SRU8043]
P1  CON162X8SM-SMALL  [HEADER2X8_SM_SMALL]
P4  CON2X3  [2X3_SHROUDED_SMT]
Q1  NPN_DUAL  [LFPAK56D]
Q2  NPN_DUAL  [LFPAK56D]
Q3  NPN_DUAL  [LFPAK56D]
Q4  NPN_DUAL  [LFPAK56D]
Q5  NPN_DUAL  [LFPAK56D]
Q6  NPN_DUAL  [LFPAK56D]
R1  10R0  RESISTOR_SM1206S  [1206S]
R2  10K0  RESISTOR_SM1206S  [1206S]
R3  4R99  R-US_R2512  [R2512]
R4  10R0  RESISTOR_SM1206S  [1206S]
R5  4R99  R-US_R2512  [R2512]
R6  0R0  RESISTOR_SM1206S  [1206S]
R7  4R99  R-US_R2512  [R2512]
R8  10K0  RESISTOR_SM1206S  [1206S]
R9  10R0  RESISTOR_SM1206S  [1206S]
R10  4R99  R-US_R2512  [R2512]
R11  4R99  R-US_R2512  [R2512]
R12  10R0  RESISTOR_SM1206S  [1206S]
R13  4R99  R-US_R2512  [R2512]
R14  4.99K  RESISTOR_SM0805S  [0805S]
R16  1R00  RESISTOR_SM1206S  [1206S]
R17  RESISTOR_SM1206S  [1206S]
R18  0R0  R-US_R1206  [R1206]
R19  1R00  RESISTOR_SM1206S  [1206S]
R20  4.99K  RESISTOR_SM0805S  [0805S]
R21  RESISTOR_SM1206S  [1206S]
R22  4R99  R-US_R2512  [R2512]
R23  10R0  RESISTOR_SM1206S  [1206S]
R24  4R99  R-US_R2512  [R2512]
R25  4R99  R-US_R2512  [R2512]
R26  10R0  RESISTOR_SM1206S  [1206S]
R27  4R99  R-US_R2512  [R2512]
R28  0R0  RESISTOR_SM1206S  [1206S]
R29  4R99  R-US_R2512  [R2512]
R30  10R0  RESISTOR_SM1206S  [1206S]
R31  0R0  RESISTOR_SM1206S  [1206S]
R32  4R99  R-US_R2512  [R2512]
R33  0R0  RESISTOR_SM1206S  [1206S]
R34  10R0  RESISTOR_SM1206S  [1206S]
RGB1  LED_RGB_PADSUNPLUS  [SUNPLUS_RGB]
RGB2  LED_RGB_PADSUNPLUS  [SUNPLUS_RGB]
RGB3  LED_RGB_PADSUNPLUS  [SUNPLUS_RGB]
RGB4  LED_RGB_PADSUNPLUS  [SUNPLUS_RGB]
RGB5  LED_RGB_PADSUNPLUS  [SUNPLUS_RGB]
RGB6  LED_RGB_PADSUNPLUS  [SUNPLUS_RGB]
RGB7  LED_RGB_PADSUNPLUS  [SUNPLUS_RGB]
RGB8  LED_RGB_PADSUNPLUS  [SUNPLUS_RGB]
RGB9  LED_RGB_PADSUNPLUS  [SUNPLUS_RGB]
RGB10  LED_RGB_PADSUNPLUS  [SUNPLUS_RGB]
RGB11  LED_RGB_PADSUNPLUS  [SUNPLUS_RGB]
RGB12  LED_RGB_PADSUNPLUS  [SUNPLUS_RGB]
RGB13  LED_RGB_PADSUNPLUS  [SUNPLUS_RGB]
RGB14  LED_RGB_PADSUNPLUS  [SUNPLUS_RGB]
RGB15  LED_RGB_PADSUNPLUS  [SUNPLUS_RGB]
RGB16  LED_RGB_PADSUNPLUS  [SUNPLUS_RGB]
RGB17  LED_RGB_PADSUNPLUS  [SUNPLUS_RGB]
RGB18  LED_RGB_PADSUNPLUS  [SUNPLUS_RGB]
RGB19  LED_RGB_PADSUNPLUS  [SUNPLUS_RGB]
RGB20  LED_RGB_PADSUNPLUS  [SUNPLUS_RGB]
RGB21  LED_RGB_PADSUNPLUS  [SUNPLUS_RGB]
RGB22  LED_RGB_PADSUNPLUS  [SUNPLUS_RGB]
RGB23  LED_RGB_PADSUNPLUS  [SUNPLUS_RGB]
RGB24  LED_RGB_PADSUNPLUS  [SUNPLUS_RGB]
RGB25  LED_RGB_PADSUNPLUS  [SUNPLUS_RGB]
RGB26  LED_RGB_PADSUNPLUS  [SUNPLUS_RGB]
RGB27  LED_RGB_PADSUNPLUS  [SUNPLUS_RGB]
RGB28  LED_RGB_PADSUNPLUS  [SUNPLUS_RGB]
RGB29  LED_RGB_PADSUNPLUS  [SUNPLUS_RGB]
RGB30  LED_RGB_PADSUNPLUS  [SUNPLUS_RGB]
RGB31  LED_RGB_PADSUNPLUS  [SUNPLUS_RGB]
RGB32  LED_RGB_PADSUNPLUS  [SUNPLUS_RGB]
U1  AP8802  [SOIC8-EP]
U2  AP8802  [SOIC8-EP]

### Nets
BLU1: P1.16 Q1.4(B2) R2.1
BLU1F: P1.14 Q1.3(E2) R5.2
BLU1K: Q1.7(C1) Q1.8(C1) Q1.78(C1) RGB1.BC
BLU1K2: Q1.5(C2) Q1.6(C2) Q1.56(C2) RGB9.BC
BLU2: P1.3 Q4.2(B1) R28.2
BLU2F: P1.5 Q4.1(E1) R22.2
BLU2K1: Q4.7(C1) Q4.8(C1) Q4.78(C1) RGB17.BC
BLU2K2: Q4.5(C2) Q4.6(C2) Q4.56(C2) RGB25.BC
G1: Q5.3(E2) R27.2
G4A1: Q5.4(B2) R31.1
GRN1: P1.15 Q2.4(B2) R6.1
GRN1F: P1.13 Q2.3(E2) R10.2
GRN1K: JMP1.1 RGB1.GC
GRN1K2: Q2.5(C2) Q2.6(C2) Q2.56(C2) RGB9.GC
GRN2: P1.2 Q5.2(B1) R31.2
GRN2F: P1.1 Q5.1(E1) R25.2
GRN2K1: JMP4.1 RGB17.GC
GRN2K2: Q5.5(C2) Q5.6(C2) Q5.56(C2) RGB25.GC
HS1: RGB2.T(PAD) RGB3.T(PAD) RGB4.T(PAD) RGB5.T(PAD) RGB6.T(PAD) RGB7.T(PAD)
HS2: RGB10.T(PAD) RGB11.T(PAD) RGB12.T(PAD) RGB13.T(PAD) RGB14.T(PAD) RGB15.T(PAD)
HS3: RGB18.T(PAD) RGB19.T(PAD) RGB20.T(PAD) RGB21.T(PAD) RGB22.T(PAD) RGB23.T(PAD)
HS4: RGB26.T(PAD) RGB27.T(PAD) RGB28.T(PAD) RGB29.T(PAD) RGB30.T(PAD) RGB31.T(PAD)
IGND1: C2.2 C3.2 C7.2 C8.2 C20.2 C21.2 JMP18.1 JMP18.2 JMP19.1 JMP19.2 R14.1 R17.2 R20.1 U1.2(GND) U1.7(GND1) U1.EP U2.2(GND) U2.7(GND1) U2.EP
IR_1: P1.9 R14.2 U1.8(CTRL)
IR_2: P1.7 R20.2 U2.8(CTRL)
IR_DRV_UL1: C4.1 C5.1 D1.A D17.A D33.A D50.A R16.1 RGB1.T(PAD) RGB9.T(PAD) U1.1(SET)
IR_DRV_UL2: C6.1 C9.1 D66.A D83.A D99.A D115.A R19.1 RGB17.T(PAD) RGB25.T(PAD) U2.1(SET)
IR_RET_UL1: C4.2 C5.2 D16.C(K) D32.C(K) D48.C(K) D65.C(K) L1.1 RGB8.T(PAD) RGB16.T(PAD)
LGND: C1.- P1.8 P1.10 P4.1 P4.3 R3.1 R5.1 R7.1 R10.1 R11.1 R13.1 R17.1 R22.1 R24.1 R25.1 R27.1 R29.1 R32.1 ; also sheet 1
N$1: RGB15.GA RGB16.GC
N$7: RGB14.GA RGB15.GC
N$12: RGB13.GA RGB14.GC
N$13: RGB12.GA RGB13.GC
N$40: RGB11.GA RGB12.GC
N$41: RGB10.GA RGB11.GC
N$42: RGB9.GA RGB10.GC
N$43: RGB15.RA RGB16.RC
N$44: RGB14.RA RGB15.RC
N$45: RGB13.RA RGB14.RC
N$46: RGB12.RA RGB13.RC
N$47: RGB11.RA RGB12.RC
N$48: RGB10.RA RGB11.RC
N$49: RGB9.RA RGB10.RC
N$50: RGB9.BA RGB10.BC
N$51: RGB10.BA RGB11.BC
N$52: RGB11.BA RGB12.BC
N$53: RGB12.BA RGB13.BC
N$54: RGB13.BA RGB14.BC
N$55: RGB14.BA RGB15.BC
N$56: RGB15.BA RGB16.BC
N$57: D51.C(K) D52.A
N$58: D52.C(K) D53.A
N$59: D54.C(K) D55.A
N$60: D56.C(K) D57.A
N$61: D50.C(K) D51.A
N$62: D53.C(K) D54.A
N$63: D55.C(K) D56.A
N$64: D59.C(K) D60.A
N$65: D60.C(K) D61.A
N$66: D62.C(K) D63.A
N$68: D64.C(K) D65.A
N$69: D58.C(K) D59.A
N$70: D61.C(K) D62.A
N$71: D63.C(K) D64.A
N$72: D34.C(K) D35.A
N$73: D35.C(K) D36.A
N$74: D37.C(K) D38.A
N$75: D39.C(K) D40.A
N$76: D33.C(K) D34.A
N$77: D36.C(K) D37.A
N$78: D38.C(K) D39.A
N$79: D42.C(K) D43.A
N$80: D43.C(K) D44.A
N$81: D45.C(K) D46.A
N$82: D47.C(K) D48.A
N$83: D41.C(K) D42.A
N$84: D44.C(K) D45.A
N$85: D46.C(K) D47.A
N$86: RGB23.GA RGB24.GC
N$87: RGB22.GA RGB23.GC
N$88: RGB21.GA RGB22.GC
N$89: RGB20.GA RGB21.GC
N$90: RGB19.GA RGB20.GC
N$91: RGB18.GA RGB19.GC
N$92: RGB17.GA RGB18.GC
N$93: RGB23.RA RGB24.RC
N$94: RGB22.RA RGB23.RC
N$95: RGB21.RA RGB22.RC
N$96: RGB20.RA RGB21.RC
N$98: RGB19.RA RGB20.RC
N$99: RGB18.RA RGB19.RC
N$100: RGB17.RA RGB18.RC
N$101: RGB17.BA RGB18.BC
N$102: RGB18.BA RGB19.BC
N$103: RGB19.BA RGB20.BC
N$104: RGB20.BA RGB21.BC
N$105: RGB21.BA RGB22.BC
N$106: RGB22.BA RGB23.BC
N$107: RGB23.BA RGB24.BC
N$108: D67.C(K) D68.A
N$109: D68.C(K) D69.A
N$110: D70.C(K) D71.A
N$111: D72.C(K) D73.A
N$112: D66.C(K) D67.A
N$113: D69.C(K) D70.A
N$114: D71.C(K) D72.A
N$115: D75.C(K) D76.A
N$116: D76.C(K) D77.A
N$117: D78.C(K) D79.A
N$118: D80.C(K) D81.A
N$119: D74.C(K) D75.A
N$120: D77.C(K) D78.A
N$121: D79.C(K) D80.A
N$122: D84.C(K) D85.A
N$123: D85.C(K) D86.A
N$124: D87.C(K) D88.A
N$125: D89.C(K) D90.A
N$126: D83.C(K) D84.A
N$127: D86.C(K) D87.A
N$128: D88.C(K) D89.A
N$129: D92.C(K) D93.A
N$130: D94.C(K) D95.A
N$131: D96.C(K) D97.A
N$132: D91.C(K) D92.A
N$133: D93.C(K) D94.A
N$134: D95.C(K) D96.A
N$135: RGB7.GA RGB8.GC
N$136: RGB6.GA RGB7.GC
N$137: RGB5.GA RGB6.GC
N$138: RGB4.GA RGB5.GC
N$139: RGB3.GA RGB4.GC
N$140: RGB2.GA RGB3.GC
N$141: RGB1.GA RGB2.GC
N$142: RGB7.RA RGB8.RC
N$143: RGB6.RA RGB7.RC
N$144: RGB5.RA RGB6.RC
N$145: RGB4.RA RGB5.RC
N$146: RGB3.RA RGB4.RC
N$147: RGB2.RA RGB3.RC
N$148: RGB1.RA RGB2.RC
N$149: RGB1.BA RGB2.BC
N$150: RGB2.BA RGB3.BC
N$151: RGB3.BA RGB4.BC
N$152: RGB4.BA RGB5.BC
N$153: RGB5.BA RGB6.BC
N$154: RGB6.BA RGB7.BC
N$155: RGB7.BA RGB8.BC
N$156: D2.C(K) D3.A
N$157: D3.C(K) D4.A
N$158: D5.C(K) D6.A
N$159: D7.C(K) D8.A
N$160: D1.C(K) D2.A
N$161: D4.C(K) D5.A
N$162: D6.C(K) D7.A
N$163: D10.C(K) D11.A
N$164: D11.C(K) D12.A
N$165: D13.C(K) D14.A
N$166: D15.C(K) D16.A
N$167: D9.C(K) D10.A
N$168: D12.C(K) D13.A
N$169: D14.C(K) D15.A
N$170: D18.C(K) D19.A
N$171: D19.C(K) D20.A
N$172: D21.C(K) D22.A
N$173: D23.C(K) D24.A
N$174: D17.C(K) D18.A
N$175: D20.C(K) D21.A
N$176: D22.C(K) D23.A
N$180: D26.C(K) D27.A
N$182: D27.C(K) D28.A
N$183: D29.C(K) D30.A
N$184: D31.C(K) D32.A
N$185: D25.C(K) D26.A
N$186: D28.C(K) D29.A
N$187: D30.C(K) D31.A
N$189: Q1.1(E1) R3.2
N$191: RGB31.GA RGB32.GC
N$192: RGB30.GA RGB31.GC
N$193: RGB29.GA RGB30.GC
N$194: RGB28.GA RGB29.GC
N$195: RGB27.GA RGB28.GC
N$196: RGB26.GA RGB27.GC
N$197: RGB25.GA RGB26.GC
N$198: RGB31.RA RGB32.RC
N$199: RGB30.RA RGB31.RC
N$200: RGB29.RA RGB30.RC
N$201: RGB28.RA RGB29.RC
N$202: RGB27.RA RGB28.RC
N$203: RGB26.RA RGB27.RC
N$204: RGB25.RA RGB26.RC
N$205: RGB25.BA RGB26.BC
N$206: RGB26.BA RGB27.BC
N$207: RGB27.BA RGB28.BC
N$208: RGB28.BA RGB29.BC
N$209: RGB29.BA RGB30.BC
N$210: RGB30.BA RGB31.BC
N$211: RGB31.BA RGB32.BC
N$212: D100.C(K) D101.A
N$213: D101.C(K) D102.A
N$214: D103.C(K) D104.A
N$215: D105.C(K) D106.A
N$216: D99.C(K) D100.A
N$217: D102.C(K) D103.A
N$218: D104.C(K) D105.A
N$219: D108.C(K) D109.A
N$220: D109.C(K) D110.A
N$221: D111.C(K) D112.A
N$222: D113.C(K) D114.A
N$223: D107.C(K) D108.A
N$224: D110.C(K) D111.A
N$225: D112.C(K) D113.A
N$226: D116.C(K) D117.A
N$227: D117.C(K) D118.A
N$228: D119.C(K) D120.A
N$229: D121.C(K) D122.A
N$231: D115.C(K) D116.A
N$232: D118.C(K) D119.A
N$234: D120.C(K) D121.A
N$236: D124.C(K) D125.A
N$237: D125.C(K) D126.A
N$246: D127.C(K) D128.A
N$247: D129.C(K) D130.A
N$252: D123.C(K) D124.A
N$253: D126.C(K) D127.A
N$254: D128.C(K) D129.A
N$255: JMP2.2 Q3.7(C1) Q3.8(C1) Q3.78(C1)
N$258: JMP1.2 Q2.7(C1) Q2.8(C1) Q2.78(C1)
N$259: Q1.2(B1) R2.2
N$260: D97.C(K) D98.A
N$263: JMP6.2 Q6.7(C1) Q6.8(C1) Q6.78(C1)
N$266: JMP4.2 Q5.7(C1) Q5.8(C1) Q5.78(C1)
N$293: D49.A L1.2 U1.5(SW) U1.6(SW1)
N$342: D82.A L2.2 U2.5(SW) U2.6(SW1)
N$343: C6.2 D81.C(K) D98.C(K) D114.C(K) D130.C(K) R21.2 RGB24.T(PAD) RGB32.T(PAD)
N$393: C9.2 L2.1 R21.1
N$394: JMP5.1 JMP7.2
N$395: Q6.4(B2) R33.1
N$396: Q4.4(B2) R28.1
N$397: Q4.3(E2) R24.2
N$398: Q3.3(E2) R13.2
N$399: Q3.4(B2) R8.1
N$402: Q2.1(E1) R7.2
N$452: Q2.2(B1) R6.2
N$453: D9.A R1.1
N$454: D8.C(K) R1.2
N$455: D24.C(K) R4.2
N$456: D25.A R4.1
N$457: D41.A R9.1
N$458: D40.C(K) R9.2
N$459: D58.A R12.1
N$460: D57.C(K) R12.2
N$461: D73.C(K) R23.2
N$462: D74.A R23.1
N$463: D91.A R26.1
N$464: D90.C(K) R26.2
N$465: D107.A R30.1
N$466: D106.C(K) R30.2
N$467: D123.A R34.1
N$468: D122.C(K) R34.2
R1: Q6.3(E2) R32.2
RED1: P1.11 Q3.2(B1) R8.2
RED1F: P1.12 Q3.1(E1) R11.2
RED1K: JMP2.1 RGB1.RC
RED1K2: Q3.5(C2) Q3.6(C2) Q3.56(C2) RGB9.RC
RED2: P1.6 Q6.2(B1) R33.2
RED2F: P1.4 Q6.1(E1) R29.2
RED2K1: JMP6.1 RGB17.RC
RED2K2: Q6.5(C2) Q6.6(C2) Q6.56(C2) RGB25.RC
V_RGB: C1.+ JMP7.1 P4.2 P4.4 RGB8.BA RGB8.GA RGB8.RA RGB16.BA RGB16.GA RGB16.RA RGB24.BA RGB24.GA RGB24.RA RGB32.BA RGB32.GA RGB32.RA ; also sheet 1
VIR1: C2.1 C3.1 C7.1 C8.1 C20.1 C21.1 D49.K D82.K JMP5.2 JMP14.1 JMP14.2 JMP15.1 JMP15.2 R16.2 R18.1 R18.2 R19.2 U1.4(VIN) U2.4(VIN)
Unconnected: P4.5 P4.6 U1.3(N/C) U2.3(N/C)

## Library data of the parts
C1 C10 C19 = adafruit:CPOL-US: POLARIZED CAPACITOR, American symbol
C2-C9 C11-C18 C20-C23 = STEVES_BU:CAPS
D1-D48 D50-D81 D83-D178 D180-D211 D213-D260 = STEVES_BU:LED
D49 D82 D179 D212 = STEVES_BU:DIODE_SCHOTTKY
J1 = STEVES_BU:POWER_JACK_SHUNT
JMP1-JMP19 = STEVES_BU:JUMPER
L1-L4 = STEVES_BU:INDUCTOR_SM
P1 P2 = STEVES_BU:CON16
P4 = STEVES_BU:CON2X3
Q1-Q12 = STEVES_BU:NPN_DUAL
R1 R2 R4 R6 R8 R9 R12 R14 R16 R17 R19-R21 R23 R26 R28 R30 R31 R33-R36 R38 R40 R42 R43 R46 R48 R50 R51 R53-R55 R57 R60 R62 R64 R65 R67 R68 = STEVES_BU:RESISTOR_SM
R3 R5 R7 R10 R11 R13 R18 R22 R24 R25 R27 R29 R32 R37 R39 R41 R44 R45 R47 R52 R56 R58 R59 R61 R63 R66 = resistor:R-US_: RESISTOR, American symbol
RGB1-RGB64 = STEVES_BU:LED_RGB_PAD
U1-U4 = STEVES_BU:AP8802
U$19 = STEVES_BU:JFRC-LOGO